# EAGLE design Placa V1 (EAGLE 9.4.0)
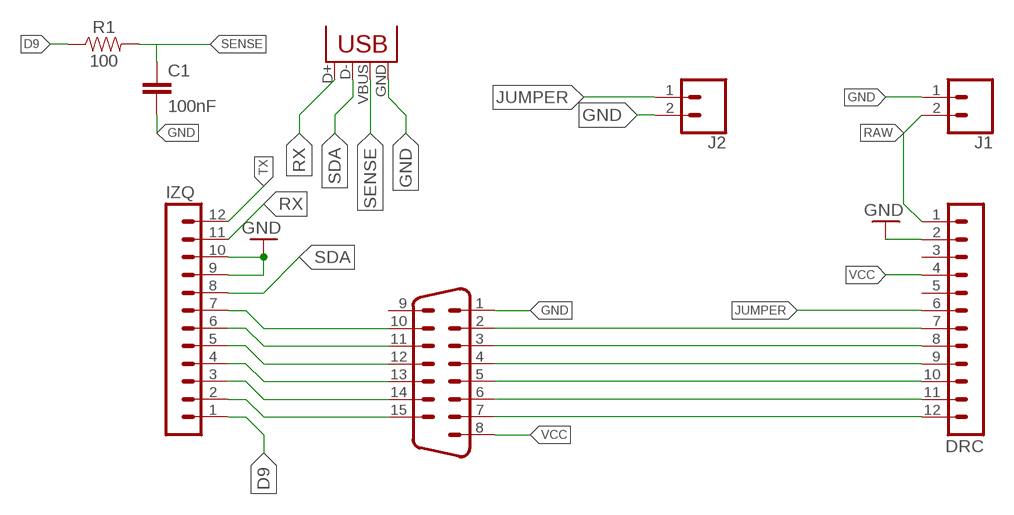
[diagram p0: schematic, sheet 1]

## Parts
C1  100nF  0.1UF-0603-25V-5%  [0603]
DRC  MA12-1  [MA12-1]
IZQ  MA12-1  [MA12-1]
J1  CONN_02  [1X02]
J2  CONN_02  [1X02]
R1  100  100OHM-0603-1/4W-5%  [0603]
X2  USB-B-H  [USB-B-H]
X3  M15V  [M15V]

## Nets
BTN2: DRC.10 X3.5
BTN4: DRC.9 X3.4
BTN6: DRC.7 X3.2
CRD: DRC.8 X3.3
D9: IZQ.1 R1.1
DWN: DRC.12 X3.7
GND [GND]: C1.2 DRC.2 IZQ.9 IZQ.10 J1.1 J2.2 X2.GND X3.1
JUMPER: DRC.6 J2.1
N$3: IZQ.7 X3.10
N$4: IZQ.6 X3.11
N$5: IZQ.5 X3.12
N$6: IZQ.4 X3.13
N$7: IZQ.3 X3.14
N$8: IZQ.2 X3.15
RAW [VCC]: DRC.1 J1.2
RGH: DRC.11 X3.6
RX: IZQ.11 X2.D+
SDA: IZQ.8 X2.D-
SENSE: C1.1 R1.2 X2.VBUS
TX: IZQ.12
VCC: DRC.4 X3.8
Unconnected: DRC.3 DRC.5 X3.9

## Library data of the parts
C1 = SparkFun-Capacitors:0.1UF: 0.1µF ceramic capacitors A capacitor is a passive two-terminal electrical component used to store electrical energy temporarily in an electric field.; PROD_ID: CAP-08604; VALUE: 0.1uF
DRC IZQ = con-lstb:MA12-1: PIN HEADER; OC_FARNELL: unknown; OC_NEWARK: unknown
J1 J2 = SparkFun-Connectors:CONN_02: Multi connection point. Often used as Generic Header-pin footprint for 0.1 inch spaced/style header connections On any of the 0.1 inch spaced packages, you can populate with these: Break Away Headers - Straight <https://www.sparkfun.com/products/116> (PRT-00116) Break Away Male Headers - Right Angle <https://www.sparkfun.com/products/553> (PRT-00553) Female Headers <https://www.sparkfun.com/products/115> (PRT-00115) Break Away Headers - Machine Pin <https://www.sparkfun.com/products/117> (PRT-00117) Break Away Female Headers - Swiss Machine Pin <https://www.sparkfun.com/products/743> (PRT-00743) For SCREWTERMINALS and SPRING TERMINALS visit here: Screw Terimnals on SparkFun.com <https://www.sparkfun.com/search/results?term=Screw+Terminals> (5mm/3.5mm/2.54mm spacing) This device is also useful as a general connection point to wire up your design to another part of your project. Our various solder wires solder well into these plated through hole pads. Hook-Up Wire - Assortment (Stranded, 22 AWG) <https://www.sparkfun.com/products/11375> (PRT-11375) Hook-Up Wire - Assortment (Solid Core, 22 AWG) <https://www.sparkfun.com/products/11367> (PRT-11367) View the entire wire category on our website here <https://www.sparkfun.com/categories/141> Special notes: Molex polarized connector foot print use with: PRT-08233 with associated crimp pins and housings. 2.54_SCREWTERM for use with PRT-10571. 3.5mm Screw Terminal footprints for PRT-08084 5mm Screw Terminal footprints for use with PRT-08432
R1 = SparkFun-Resistors:100OHM: 100Ω resistor A resistor is a passive two-terminal electrical component that implements electrical resistance as a circuit element. Resistors act to reduce current flow, and, at the same time, act to lower voltage levels within circuits. - Wikipedia; PROD_ID: RES-12438
X2 = con-usb:USB: USB Connectors
X3 = con-subd:M15: SUB-D; OC_FARNELL: unknown; OC_NEWARK: unknown

## Net classes
0 default: width 0.254 mm
1 GND: width 0.457 mm
2 VCC: width 0.457 mm

## Board
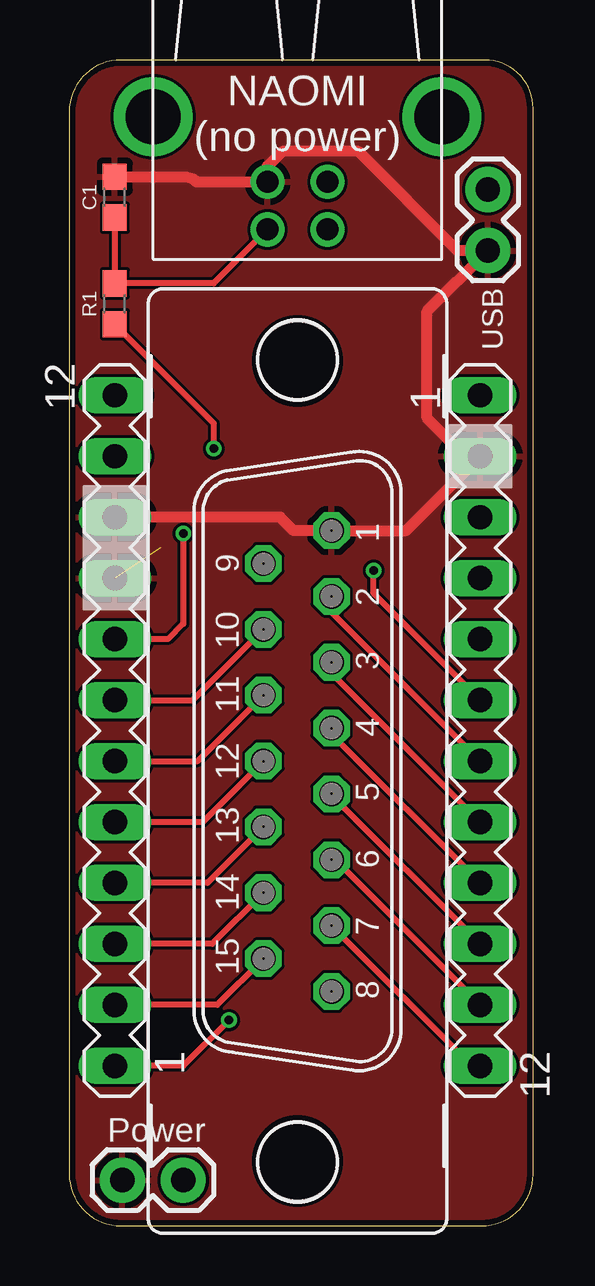
[diagram p1: board, top side]
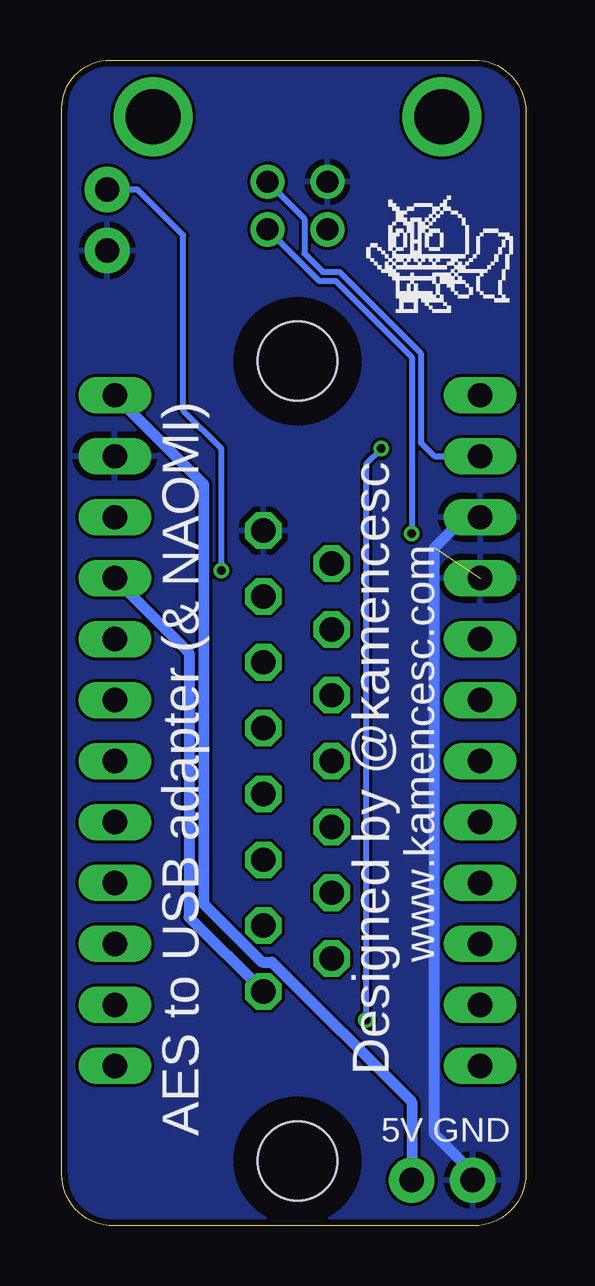
[diagram p2: board, bottom side, seen from below]

Size 19.36 x 48.58 mm. Coordinates in mm from the lower left corner, seen from the top.
Outline: 0,46.41 0,2.17 arc90 2.17,0 17.21,0 arc90 19.36,2.15 19.36,46.56 arc90 17.34,48.58 2.17,48.58 arc90 0,46.41
Copper layers (1*16): Top 0.035mm / dielectric 1.5mm / Bottom 0.035mm
Design rules "dirtypcbs_2_layer": minimum track width 5mil, minimum drill 12mil, track to track 5mil, track to pad 5mil, pad to pad 5mil, via to via 5mil, smd to smd 0mil, copper to edge 10mil, drill to drill 10mil, minimum pad ring 10mil, minimum via ring 6mil, stop-mask expansion 2mil, vias tented up to drill 25mil, thermal gap 10mil

### Footprints (pad centres in the part's own frame; a part is rotated, then mirrored left to right if it is on the bottom)
0603 = smd 1.1 x 1: 1 -0.85,0; 2 0.85,0
MA12-1 = drill 1.016 long: 1 -13.97,0; 2 -11.43,0; 3 -8.89,0; 4 -6.35,0; 5 -3.81,0; 6 -1.27,0; 7 1.27,0; 8 3.81,0; 9 6.35,0; 10 8.89,0; 11 11.43,0; 12 13.97,0
1X02 = drill 1.016 pad 1.88: 1 0,0; 2 2.54,0
USB-B-H = drill 0.914: D+ 0,1.25; D- 1.981,1.25; GND 0,-1.25; VBUS 1.981,-1.25 | drill 2.286: P$1 -2.718,-6.02; P$2 -2.718,6.02
M15V = drill 1.016 octagon: 1 -9.601,1.422; 2 -6.858,1.422; 3 -4.115,1.422; 4 -1.372,1.422; 5 1.372,1.422; 6 4.115,1.422; 7 6.858,1.422; 8 9.601,1.422; 9 -8.23,-1.422; 10 -5.486,-1.422; 11 -2.743,-1.422; 12 0,-1.422; 13 2.743,-1.422; 14 5.486,-1.422; 15 8.23,-1.422 | hole 3.302: 16.662,0; -16.662,0

### Placement (x,y rotation side)
C1  1.91,42.86 90 top
DRC  17.14,20.64 270 top
IZQ  1.91,20.64 90 top
J1  2.22,1.91 0 top
J2  17.46,43.18 270 top
R1  1.91,38.42 90 top
X2  9.53,43.5 270 top
X3  9.53,19.37 270 top

### Tracks (layer width: path | path; a pad name or v marks a point on that pad's centre or on a via)
BTN2
  Top 0.152: 10.95,17.95 X3.5
  Top 0.254: DRC.10 10.95,17.95
BTN4
  Top 0.152: X3.4 10.95,20.49
  Top 0.254: 10.95,20.49 DRC.9
BTN6
  Top 0.254: X3.2 10.95,25.57 DRC.7
CRD
  Top 0.254: X3.3 10.95,23.03 DRC.8
D9  (via drill 0.35)
  Top 0.254: R1.1 6.03,33.44 v6.03,32.39 | v6.67,8.57 4.76,6.67 IZQ.1
  Bottom 0.254: v6.03,32.39 6.67,31.75 v6.67,8.57
DWN
  Top 0.152: DRC.12 16.79,6.67
  Top 0.254: 16.79,6.67 X3.7
GND  (1 unrouted)
  Top 0.457: IZQ.10 8.8,29.53 9.36,28.97 X3.1 14.05,28.97 DRC.2 16.51,32.07 14.92,33.65 14.92,38.1 J2.2 16.19,40.64 12.06,44.77 8.89,44.77 8.28,44.15 X2.GND 5.3,43.5 5.2,43.6 4.88,43.71 C1.2
  Bottom 0.457: J1.1 2.22,2.22 3.81,3.81 3.81,28.26 2.54,29.53 IZQ.10
  pour Top: 20.32,-0.63 -0.64,-0.63 -0.64,48.58 20.32,48.58
  pour Bottom: -1.27,49.21 20,49.21 20,-0.32 -1.27,-0.32
JUMPER  (via drill 0.35)
  Top 0.254: DRC.6 12.7,26.35 v12.7,27.31
  Bottom 0.254: v12.7,27.31 12.7,32.39 14.29,33.97 14.29,41.28 16.19,43.18 J2.1
N$3
  Top 0.254: IZQ.7 5.16,21.91 X3.10
N$4
  Top 0.254: IZQ.6 5.36,19.37 X3.11
N$5
  Top 0.254: X3.12 5.56,16.83 IZQ.5
N$6
  Top 0.254: X3.13 5.77,14.29 IZQ.4
N$7
  Top 0.254: X3.14 5.97,11.75 IZQ.3
N$8
  Top 0.254: X3.15 6.17,9.21 IZQ.2
RAW
  Bottom 0.457: DRC.1 13.43,30.9 13.43,13.41 11.01,10.99 10.59,10.99 4.76,5.16 J1.2
RGH
  Top 0.152: 11.1,15.25 X3.6
  Top 0.254: DRC.11 11.1,15.25
RX
  Bottom 0.254: IZQ.11 3.81,32.07 4.38,32.64 4.38,36.35 7.78,39.75 8.47,39.75 9.24,40.52 9.24,41.96 X2.D+
SDA  (via drill 0.35)
  Top 0.254: v4.76,28.84 4.76,25.08 4.13,24.45 IZQ.8
  Bottom 0.254: X2.D- 8.63,39.37 7.94,39.37 4.76,36.2 v4.76,28.84
SENSE
  Top 0.254: X2.VBUS 6.03,39.27 R1.2 C1.1
VCC
  Bottom 0.457: DRC.4 14.05,23.89 14.05,12.87 X3.8

### Text on the board
tPlace: Power
bPlace: 5V GND
tNames: NAOMI | (no power) | USB
bNames: www.kamencesc.com | Designed by @kamencesc | AES to USB adapter (& NAOMI)